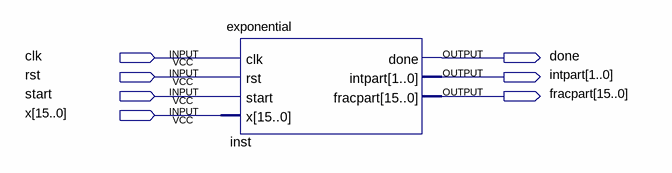
[diagram p0: schematic sheet]
// Quartus schematic ExpEngine.bdf as structural Verilog: 1 symbols, 7 pins
module ExpEngine (
  input  clk,
  input  rst,
  input  start,
  input  [15:0] x,
  output done,
  output [1:0] intpart,
  output [15:0] fracpart
);

  exponential inst (.clk(clk), .rst(rst), .start(start), .x(x), .done(done), .intpart(intpart), .fracpart(fracpart));
endmodule
